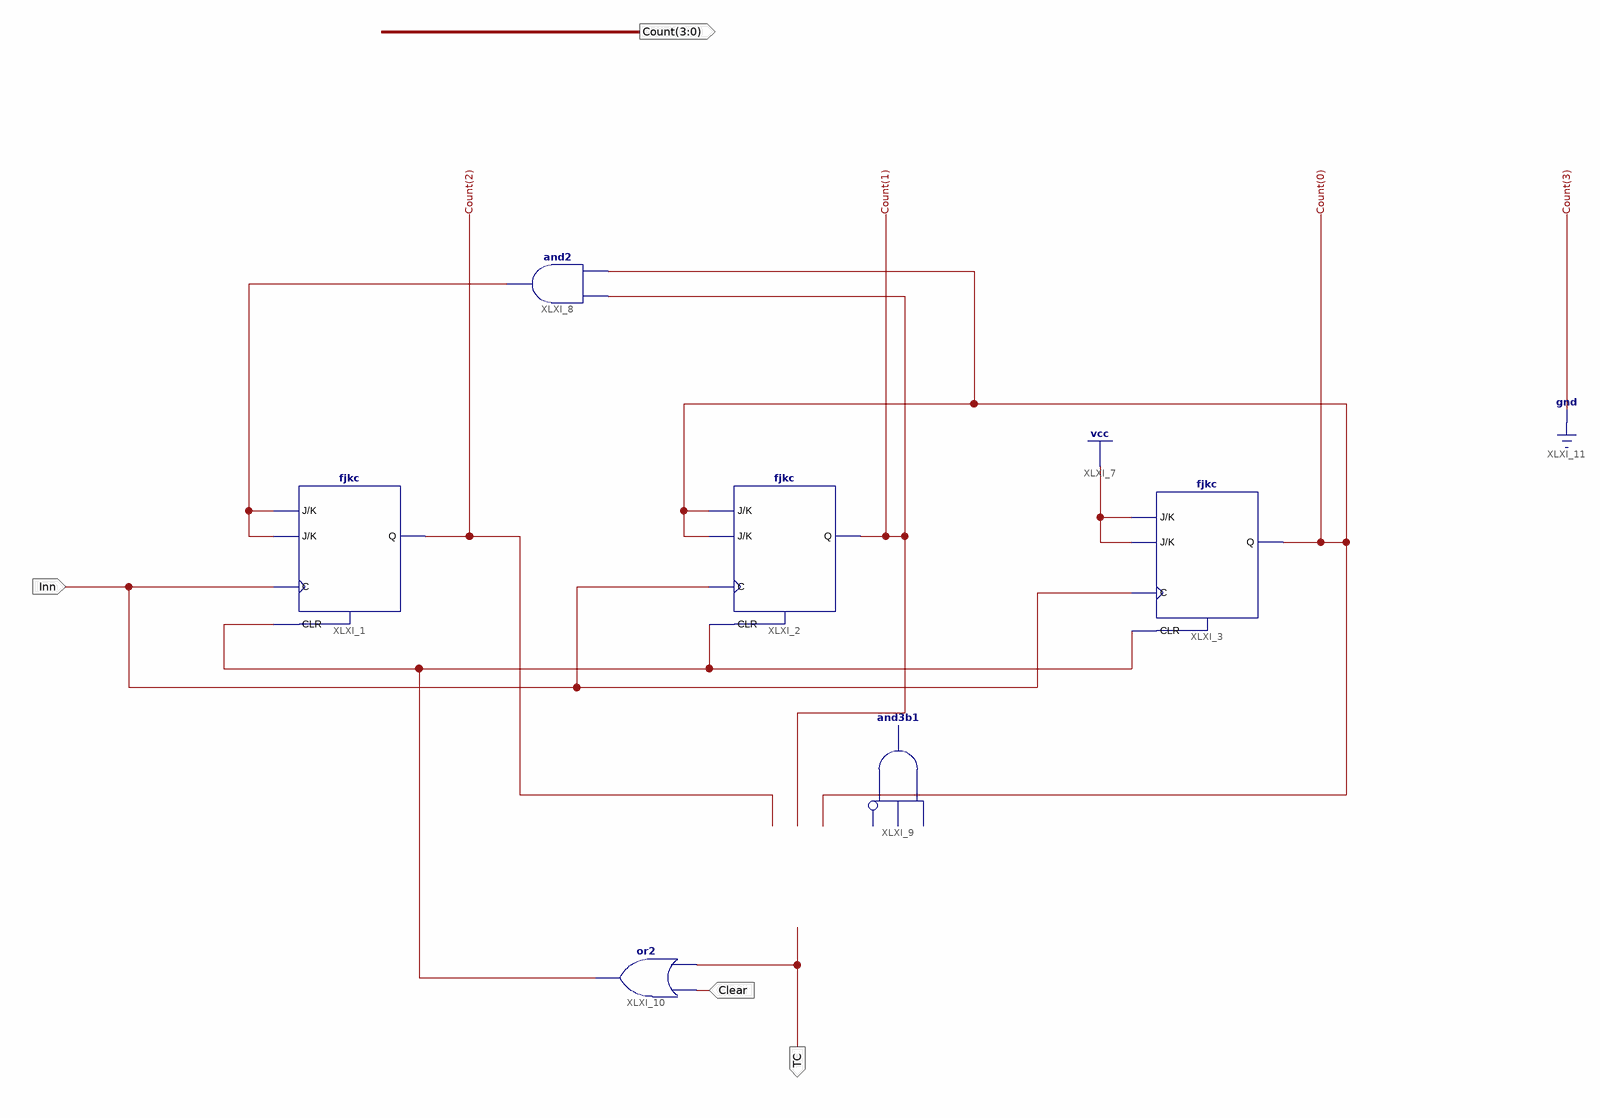
[diagram p0: schematic sheet 1]
// Xilinx ISE schematic Counter0_5_new.sch (spartan6) as structural Verilog: 6 symbols, 4 ports
module Counter0_5_new (
  input  Inn,
  input  Clear,
  output TC,
  output [3:0] Count
);

  wire XLXN_6, XLXN_19;

  fjkc XLXI_1 (.C(Inn), .CLR(XLXN_19), .J(XLXN_6), .K(XLXN_6), .Q(Count[2]));
  fjkc XLXI_2 (.C(Inn), .CLR(XLXN_19), .J(Count[0]), .K(Count[0]), .Q(Count[1]));
  fjkc XLXI_3 (.C(Inn), .CLR(XLXN_19), .J(1'b1), .K(1'b1), .Q(Count[0]));
  and XLXI_8 (XLXN_6, Count[1], Count[0]);
  and XLXI_9 (TC, ~Count[0], Count[1], Count[2]);  // and3b1
  or XLXI_10 (XLXN_19, Clear, TC);

  assign Count[3] = 1'b0;
endmodule
